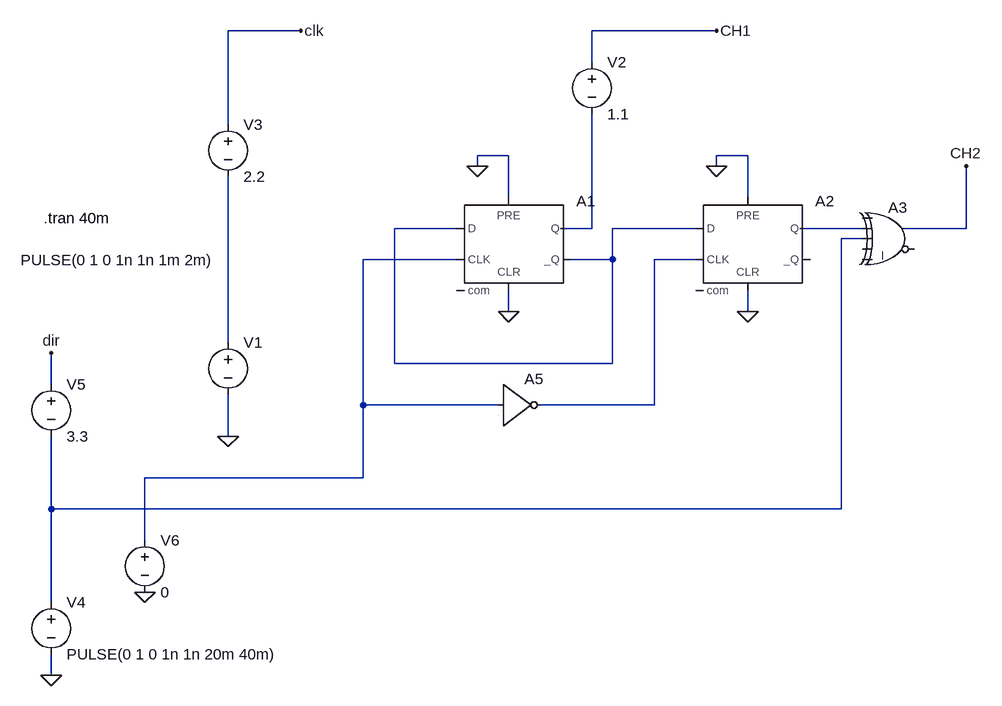
[diagram p0: schematic Quadrature.asc]
Quadrature.asc, the LTspice schematic file:
Version 4
SHEET 1 1004 932
WIRE -64 -160 -176 -160
WIRE 576 -160 384 -160
WIRE 384 -112 384 -160
WIRE -176 -16 -176 -160
WIRE 256 32 208 32
WIRE 624 32 576 32
WIRE 208 48 208 32
WIRE 576 48 576 32
WIRE 256 96 256 32
WIRE 624 96 624 32
WIRE 176 144 80 144
WIRE 384 144 384 -32
WIRE 384 144 336 144
WIRE 544 144 416 144
WIRE 800 144 704 144
WIRE 960 144 960 48
WIRE 960 144 864 144
WIRE 800 160 768 160
WIRE 176 192 32 192
WIRE 416 192 416 144
WIRE 416 192 352 192
WIRE 544 192 480 192
WIRE 256 272 256 240
WIRE 624 272 624 240
WIRE -176 320 -176 64
WIRE 80 352 80 144
WIRE 416 352 416 192
WIRE 416 352 80 352
WIRE -448 384 -448 336
WIRE 32 416 32 192
WIRE 240 416 32 416
WIRE 480 416 480 192
WIRE 480 416 304 416
WIRE -176 464 -176 400
WIRE 32 528 32 416
WIRE 32 528 -304 528
WIRE -448 576 -448 464
WIRE 768 576 768 160
WIRE 768 576 -448 576
WIRE -304 624 -304 528
WIRE -448 720 -448 576
WIRE -448 832 -448 800
FLAG 256 272 0
FLAG 624 272 0
FLAG 208 48 0
FLAG 576 48 0
FLAG -176 464 0
FLAG 576 -160 CH1
FLAG 960 48 CH2
FLAG -64 -160 clk
FLAG -448 832 0
FLAG -448 336 dir
FLAG -304 704 0
SYMBOL Digital\\dflop 256 96 R0
SYMATTR InstName A1
SYMBOL Digital\\dflop 624 96 R0
SYMATTR InstName A2
SYMBOL voltage -176 304 R0
WINDOW 3 -319 -111 Left 0
WINDOW 123 0 0 Left 0
WINDOW 39 0 0 Left 0
SYMATTR InstName V1
SYMATTR Value PULSE(0 1 0 1n 1n 1m 2m)
SYMBOL voltage 384 -128 R0
WINDOW 123 0 0 Left 0
WINDOW 39 0 0 Left 0
SYMATTR InstName V2
SYMATTR Value 1.1
SYMBOL voltage -176 -32 R0
WINDOW 123 0 0 Left 0
WINDOW 39 0 0 Left 0
SYMATTR InstName V3
SYMATTR Value 2.2
SYMBOL voltage -448 704 R0
WINDOW 123 0 0 Left 0
WINDOW 39 0 0 Left 0
SYMATTR InstName V4
SYMATTR Value PULSE(0 1 0 1n 1n 20m 40m)
SYMBOL Digital\\inv 240 352 R0
SYMATTR InstName A5
SYMBOL Digital\\xor 848 96 R0
SYMATTR InstName A3
SYMBOL voltage -448 368 R0
WINDOW 123 0 0 Left 0
WINDOW 39 0 0 Left 0
SYMATTR InstName V5
SYMATTR Value 3.3
SYMBOL voltage -304 608 R0
WINDOW 123 0 0 Left 0
WINDOW 39 0 0 Left 0
SYMATTR InstName V6
SYMATTR Value 0
TEXT -460 128 Left 0 !.tran 40m

The netlist it stands for:
* Quadrature.asc
A1 N001 0 N005 0 0 N001 N002 0 DFLOP
A2 N001 0 N006 0 0 0 N003 0 DFLOP
V1 N007 0 PULSE(0 1 0 1n 1n 1m 2m)
V2 CH1 N002 1.1
V3 clk N007 2.2
V4 N004 0 PULSE(0 1 0 1n 1n 20m 40m)
A5 N005 0 0 0 0 N006 0 0 BUF
A3 0 N003 N004 0 0 0 CH2 0 XOR
V5 dir N004 3.3
V6 N005 0 0
.tran 40m
.backanno
.end